# EAGLE schematic STM32MP1_board (EAGLE 6.4)

## Sheet 1 of 3: CPU
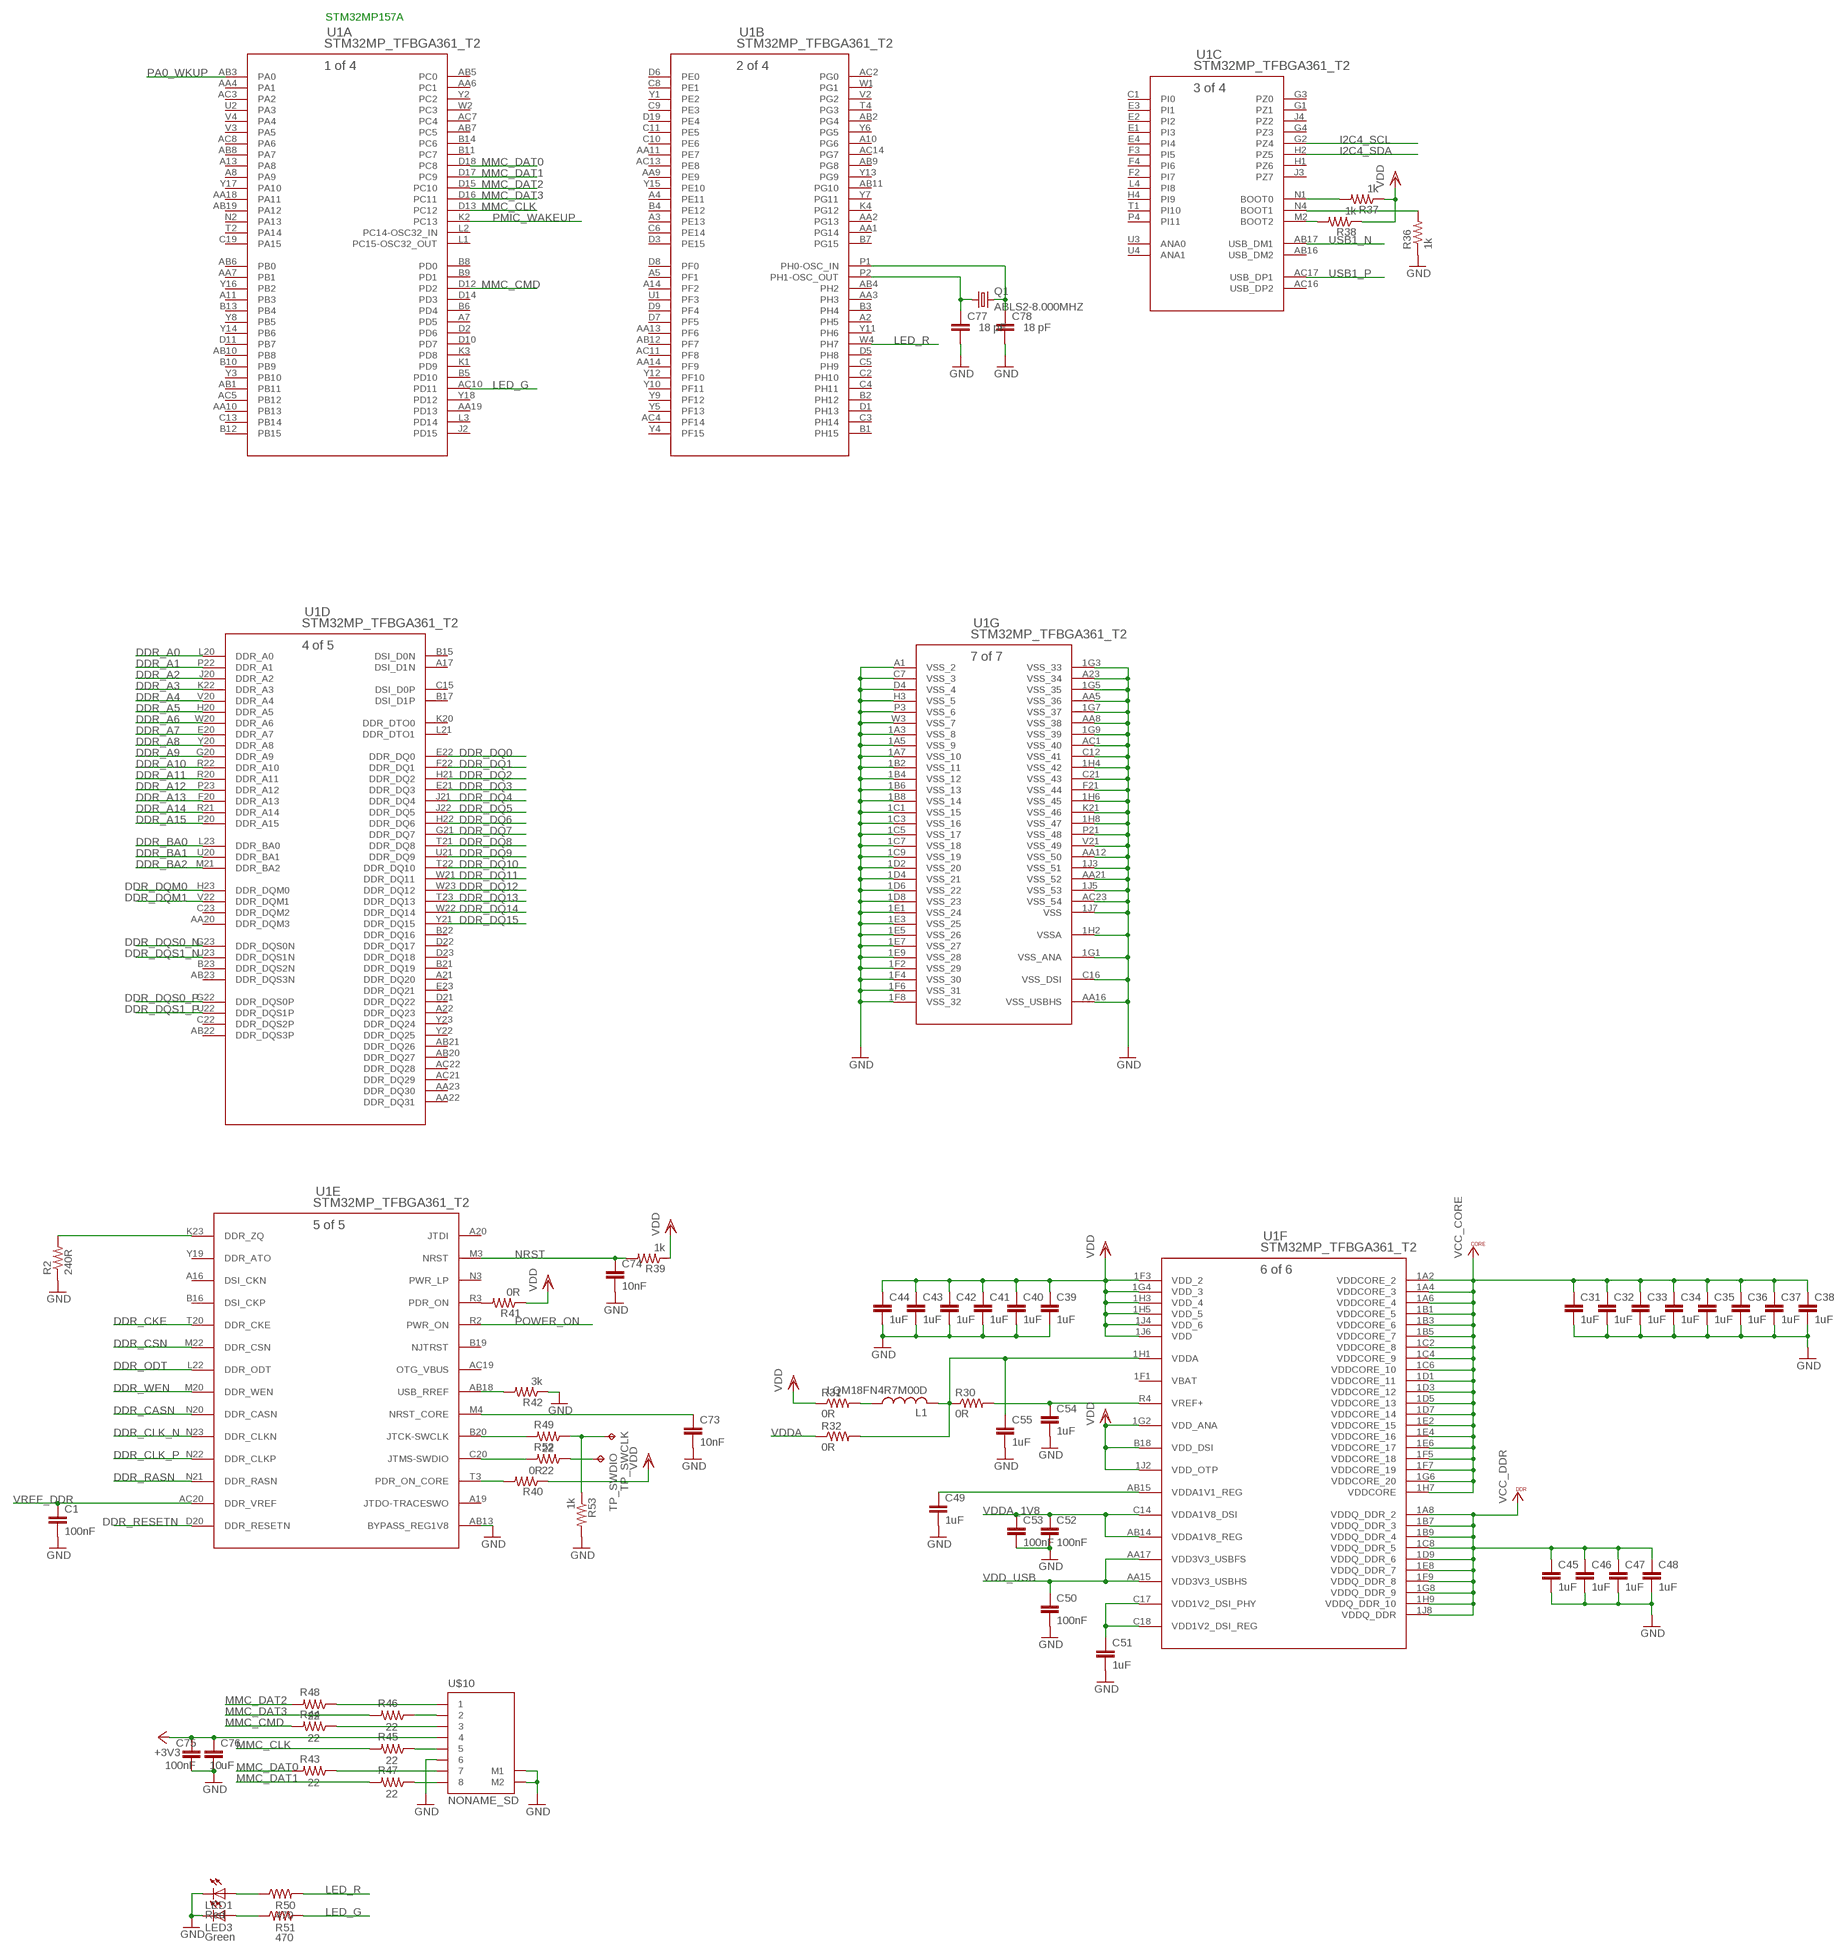
[diagram p0: schematic, sheet 1]

### Parts
C1  100nF  C-EUC0402K  [C0402K]
C31  1uF  C-EUC0402K  [C0402K]
C32  1uF  C-EUC0402K  [C0402K]
C33  1uF  C-EUC0402K  [C0402K]
C34  1uF  C-EUC0402K  [C0402K]
C35  1uF  C-EUC0402K  [C0402K]
C36  1uF  C-EUC0402K  [C0402K]
C37  1uF  C-EUC0402K  [C0402K]
C38  1uF  C-EUC0402K  [C0402K]
C39  1uF  C-EUC0402K  [C0402K]
C40  1uF  C-EUC0402K  [C0402K]
C41  1uF  C-EUC0402K  [C0402K]
C42  1uF  C-EUC0402K  [C0402K]
C43  1uF  C-EUC0402K  [C0402K]
C44  1uF  C-EUC0402K  [C0402K]
C45  1uF  C-EUC0402K  [C0402K]
C46  1uF  C-EUC0402K  [C0402K]
C47  1uF  C-EUC0402K  [C0402K]
C48  1uF  C-EUC0402K  [C0402K]
C49  1uF  C-EUC0402K  [C0402K]
C50  100nF  C-EUC0402K  [C0402K]
C51  1uF  C-EUC0402K  [C0402K]
C52  100nF  C-EUC0402K  [C0402K]
C53  100nF  C-EUC0402K  [C0402K]
C54  1uF  C-EUC0402K  [C0402K]
C55  1uF  C-EUC0402K  [C0402K]
C73  10nF  C-EUC0402K  [C0402K]
C74  10nF  C-EUC0402K  [C0402K]
C75  100nF  C-EUC0402K  [C0402K]
C76  10uF  C-EUC0603K  [C0603K]
C77  18 pF  C-EUC0603  [C0603]
C78  18 pF  C-EUC0603  [C0603]
L1  LQM18FN4R7M00D  L-US  [R0603]
LED1  Red  LED_ESML0603  [LED_SML0603]
LED3  Green  LED_ESML0603  [LED_SML0603]
Q1  ABLS2-8.000MHZ  CRYSTALSM49  [SM49]
R2  240R  R-US_R0402  [R0402]
R30  0R  R-US_R0402  [R0402]
R31  0R  R-US_R0402  [R0402]
R32  0R  R-US_R0402  [R0402]
R36  1k  R-US_R0402  [R0402]
R37  1k  R-US_R0402  [R0402]
R38  1k  R-US_R0402  [R0402]
R39  1k  R-US_R0402  [R0402]
R40  0R  R-US_R0402  [R0402]
R41  0R  R-US_R0402  [R0402]
R42  3k  R-US_R0402  [R0402]
R43  22  R-US_R0402  [R0402]
R44  22  R-US_R0402  [R0402]
R45  22  R-US_R0402  [R0402]
R46  22  R-US_R0402  [R0402]
R47  22  R-US_R0402  [R0402]
R48  22  R-US_R0402  [R0402]
R49  22  R-US_R0402  [R0402]
R50  470  R-US_R0402  [R0402]
R51  470  R-US_R0402  [R0402]
R52  22  R-US_R0402  [R0402]
R53  1k  R-US_R0402  [R0402]
TP_SWCLK  TPTP10SQ  [TP10SQ]
TP_SWDIO  TPTP10SQ  [TP10SQ]
U1  STM32MP_TFBGA361_T2  [TFBGA361_12X12]
U$10  NONAME_SD  [NONAME_SD]

### Nets
+3V3: C75.1 C76.1 U$10.4 ; also sheet 3
DDR_A0: U1.L20(D:DDR_A0) ; also sheet 2
DDR_A1: U1.P22(D:DDR_A1) ; also sheet 2
DDR_A2: U1.J20(D:DDR_A2) ; also sheet 2
DDR_A3: U1.K22(D:DDR_A3) ; also sheet 2
DDR_A4: U1.V20(D:DDR_A4) ; also sheet 2
DDR_A5: U1.H20(D:DDR_A5) ; also sheet 2
DDR_A6: U1.W20(D:DDR_A6) ; also sheet 2
DDR_A7: U1.E20(D:DDR_A7) ; also sheet 2
DDR_A8: U1.Y20(D:DDR_A8) ; also sheet 2
DDR_A9: U1.G20(D:DDR_A9) ; also sheet 2
DDR_A10: U1.R22(D:DDR_A10) ; also sheet 2
DDR_A11: U1.R20(D:DDR_A11) ; also sheet 2
DDR_A12: U1.P23(D:DDR_A12) ; also sheet 2
DDR_A13: U1.F20(D:DDR_A13) ; also sheet 2
DDR_A14: U1.R21(D:DDR_A14) ; also sheet 2
DDR_A15: U1.P20(D:DDR_A15)
DDR_BA0: U1.L23(D:DDR_BA0) ; also sheet 2
DDR_BA1: U1.U20(D:DDR_BA1) ; also sheet 2
DDR_BA2: U1.M21(D:DDR_BA2) ; also sheet 2
DDR_CASN: U1.N20(E:DDR_CASN) ; also sheet 2
DDR_CKE: U1.T20(E:DDR_CKE) ; also sheet 2
DDR_CLK_N: U1.N23(E:DDR_CLKN) ; also sheet 2
DDR_CLK_P: U1.N22(E:DDR_CLKP) ; also sheet 2
DDR_CSN: U1.M22(E:DDR_CSN) ; also sheet 2
DDR_DQ0: U1.E22(D:DDR_DQ0) ; also sheet 2
DDR_DQ1: U1.F22(D:DDR_DQ1) ; also sheet 2
DDR_DQ2: U1.H21(D:DDR_DQ2) ; also sheet 2
DDR_DQ3: U1.E21(D:DDR_DQ3) ; also sheet 2
DDR_DQ4: U1.J21(D:DDR_DQ4) ; also sheet 2
DDR_DQ5: U1.J22(D:DDR_DQ5) ; also sheet 2
DDR_DQ6: U1.H22(D:DDR_DQ6) ; also sheet 2
DDR_DQ7: U1.G21(D:DDR_DQ7) ; also sheet 2
DDR_DQ8: U1.T21(D:DDR_DQ8) ; also sheet 2
DDR_DQ9: U1.U21(D:DDR_DQ9) ; also sheet 2
DDR_DQ10: U1.T22(D:DDR_DQ10) ; also sheet 2
DDR_DQ11: U1.W21(D:DDR_DQ11) ; also sheet 2
DDR_DQ12: U1.W23(D:DDR_DQ12) ; also sheet 2
DDR_DQ13: U1.T23(D:DDR_DQ13) ; also sheet 2
DDR_DQ14: U1.W22(D:DDR_DQ14) ; also sheet 2
DDR_DQ15: U1.Y21(D:DDR_DQ15) ; also sheet 2
DDR_DQM0: U1.H23(D:DDR_DQM0) ; also sheet 2
DDR_DQM1: U1.V22(D:DDR_DQM1) ; also sheet 2
DDR_DQS0_N: U1.G23(D:DDR_DQS0N) ; also sheet 2
DDR_DQS0_P: U1.G22(D:DDR_DQS0P) ; also sheet 2
DDR_DQS1_N: U1.U23(D:DDR_DQS1N) ; also sheet 2
DDR_DQS1_P: U1.U22(D:DDR_DQS1P) ; also sheet 2
DDR_ODT: U1.L22(E:DDR_ODT) ; also sheet 2
DDR_RASN: U1.N21(E:DDR_RASN) ; also sheet 2
DDR_RESETN: U1.D20(E:DDR_RESETN) ; also sheet 2
DDR_WEN: U1.M20(E:DDR_WEN) ; also sheet 2
GND: C1.2 C31.2 C32.2 C33.2 C34.2 C35.2 C36.2 C37.2 C38.2 C39.2 C40.2 C41.2 C42.2 C43.2 C44.2 C45.2 C46.2 C47.2 C48.2 C49.2 C50.2 C51.2 C52.2 C53.2 C54.2 C55.2 C73.2 C74.2 C75.2 C76.2 C77.2 C78.2 LED1.C LED3.C R2.1 R36.1 R42.1 R53.2 U1.1A3(G:VSS_8) U1.1A5(G:VSS_9) U1.1A7(G:VSS_10) U1.1B2(G:VSS_11) U1.1B4(G:VSS_12) U1.1B6(G:VSS_13) U1.1B8(G:VSS_14) U1.1C1(G:VSS_15) U1.1C3(G:VSS_16) U1.1C5(G:VSS_17) U1.1C7(G:VSS_18) U1.1C9(G:VSS_19) U1.1D2(G:VSS_20) U1.1D4(G:VSS_21) U1.1D6(G:VSS_22) U1.1D8(G:VSS_23) U1.1E1(G:VSS_24) U1.1E3(G:VSS_25) U1.1E5(G:VSS_26) U1.1E7(G:VSS_27) U1.1E9(G:VSS_28) U1.1F2(G:VSS_29) U1.1F4(G:VSS_30) U1.1F6(G:VSS_31) U1.1F8(G:VSS_32) U1.1G1(G:VSS_ANA) U1.1G3(G:VSS_33) U1.1G5(G:VSS_35) U1.1G7(G:VSS_37) U1.1G9(G:VSS_39) U1.1H2(G:VSSA) U1.1H4(G:VSS_42) U1.1H6(G:VSS_45) U1.1H8(G:VSS_47) U1.1J3(G:VSS_51) U1.1J5(G:VSS_53) U1.1J7(G:VSS) U1.A1(G:VSS_2) U1.A23(G:VSS_34) U1.AA5(G:VSS_36) U1.AA8(G:VSS_38) U1.AA12(G:VSS_50) U1.AA16(G:VSS_USBHS) U1.AA21(G:VSS_52) U1.AB13(E:BYPASS_REG1V8) U1.AC1(G:VSS_40) U1.AC23(G:VSS_54) U1.C7(G:VSS_3) U1.C12(G:VSS_41) U1.C16(G:VSS_DSI) U1.C21(G:VSS_43) U1.D4(G:VSS_4) U1.F21(G:VSS_44) U1.H3(G:VSS_5) U1.K21(G:VSS_46) U1.P3(G:VSS_6) U1.P21(G:VSS_48) U1.V21(G:VSS_49) U1.W3(G:VSS_7) U$10.6 U$10.M1 U$10.M2 ; also sheet 2,3
I2C4_SCL: U1.G2(C:PZ4) ; also sheet 3
I2C4_SDA: U1.H2(C:PZ5) ; also sheet 3
LED_G: R51.2 U1.AC10(A:PD11)
LED_R: R50.2 U1.W4(B:PH7)
MMC_CLK: R45.2 U1.D13(A:PC12)
MMC_CMD: R44.2 U1.D12(A:PD2)
MMC_DAT0: R43.2 U1.D18(A:PC8)
MMC_DAT1: R47.2 U1.D17(A:PC9)
MMC_DAT2: R48.2 U1.D15(A:PC10)
MMC_DAT3: R46.2 U1.D16(A:PC11)
N$2: R2.2 U1.K23(E:DDR_ZQ)
N$3: C49.1 U1.AB15(F:VDDA1V1_REG)
N$4: C51.1 U1.C17(F:VDD1V2_DSI_PHY) U1.C18(F:VDD1V2_DSI_REG)
N$5: C55.1 L1.2 R30.1 R32.2 U1.1H1(F:VDDA)
N$6: C54.1 R30.2 U1.R4(F:VREF+)
N$7: L1.1 R31.2
N$15: C73.1 U1.M4(E:NRST_CORE)
N$17: R36.2 U1.N4(C:BOOT1)
N$18: R37.2 U1.N1(C:BOOT0)
N$19: R38.2 U1.M2(C:BOOT2)
N$20: C74.1 R39.2
N$21: R40.2 U1.T3(E:PDR_ON_CORE)
N$22: R41.2 U1.R3(E:PDR_ON)
N$23: R42.2 U1.AB18(E:USB_RREF)
N$24: R49.2 U1.B20(E:JTCK-SWCLK)
N$25: R52.2 U1.C20(E:JTMS-SWDIO)
N$26: R48.1 U$10.1
N$27: R46.1 U$10.2
N$28: R44.1 U$10.3
N$29: R45.1 U$10.5
N$30: R43.1 U$10.7
N$31: R47.1 U$10.8
N$32: R49.1 R53.1 TP_SWCLK.TP
N$33: R52.1 TP_SWDIO.TP
N$34: C78.1 Q1.2 U1.P1(B:PH0-OSC_IN)
N$35: C77.1 Q1.1 U1.P2(B:PH1-OSC_OUT)
N$37: LED1.A R50.1
N$39: LED3.A R51.1
NRST: U1.M3(E:NRST) ; also sheet 3
PA0_WKUP: U1.AB3(A:PA0) ; also sheet 3
PMIC_WAKEUP: U1.K2(A:PC13) ; also sheet 3
POWER_ON: U1.R2(E:PWR_ON) ; also sheet 3
USB1_N: U1.AB17(C:USB_DM1)
USB1_P: U1.AC17(C:USB_DP1)
VCC_CORE: C31.1 C32.1 C33.1 C34.1 C35.1 C36.1 C37.1 C38.1 U1.1A2(F:VDDCORE_2) U1.1A4(F:VDDCORE_3) U1.1A6(F:VDDCORE_4) U1.1B1(F:VDDCORE_5) U1.1B3(F:VDDCORE_6) U1.1B5(F:VDDCORE_7) U1.1C2(F:VDDCORE_8) U1.1C4(F:VDDCORE_9) U1.1C6(F:VDDCORE_10) U1.1D1(F:VDDCORE_11) U1.1D3(F:VDDCORE_12) U1.1D5(F:VDDCORE_13) U1.1D7(F:VDDCORE_14) U1.1E2(F:VDDCORE_15) U1.1E4(F:VDDCORE_16) U1.1E6(F:VDDCORE_17) U1.1F5(F:VDDCORE_18) U1.1F7(F:VDDCORE_19) U1.1G6(F:VDDCORE_20) U1.1H7(F:VDDCORE) ; also sheet 3
VCC_DDR: C45.1 C46.1 C47.1 C48.1 U1.1A8(F:VDDQ_DDR_2) U1.1B7(F:VDDQ_DDR_3) U1.1B9(F:VDDQ_DDR_4) U1.1C8(F:VDDQ_DDR_5) U1.1D9(F:VDDQ_DDR_6) U1.1E8(F:VDDQ_DDR_7) U1.1F9(F:VDDQ_DDR_8) U1.1G8(F:VDDQ_DDR_9) U1.1H9(F:VDDQ_DDR_10) U1.1J8(F:VDDQ_DDR) ; also sheet 2,3
VDD: C39.1 C40.1 C41.1 C42.1 C43.1 C44.1 R31.1 R37.1 R38.1 R39.1 R40.1 R41.1 U1.1F3(F:VDD_2) U1.1G2(F:VDD_ANA) U1.1G4(F:VDD_3) U1.1H3(F:VDD_4) U1.1H5(F:VDD_5) U1.1J2(F:VDD_OTP) U1.1J4(F:VDD_6) U1.1J6(F:VDD) U1.B18(F:VDD_DSI) ; also sheet 3
VDD_USB: C50.1 U1.AA15(F:VDD3V3_USBHS) U1.AA17(F:VDD3V3_USBFS) ; also sheet 3
VDDA: R32.1 ; also sheet 3
VDDA_1V8: C52.1 C53.1 U1.AB14(F:VDDA1V8_REG) U1.C14(F:VDDA1V8_DSI)
VREF_DDR: C1.1 U1.AC20(E:DDR_VREF) ; also sheet 2,3
Unconnected: U1.A2(B:PH5) U1.A3(B:PE13) U1.A4(B:PE11) U1.A5(B:PF1) U1.A7(A:PD5) U1.A8(A:PA9) U1.A10(B:PG6) U1.A11(A:PB3) U1.A13(A:PA8) U1.A14(B:PF2) U1.A16(E:DSI_CKN) U1.A17(D:DSI_D1N) U1.A19(E:JTDO-TRACESWO) U1.A20(E:JTDI) U1.A21(D:DDR_DQ20) U1.A22(D:DDR_DQ23) U1.AA1(B:PG14) U1.AA2(B:PG13) U1.AA3(B:PH3) U1.AA4(A:PA1) U1.AA6(A:PC1) U1.AA7(A:PB1) U1.AA9(B:PE9) U1.AA10(A:PB13) U1.AA11(B:PE7) U1.AA13(B:PF6) U1.AA14(B:PF9) U1.AA18(A:PA11) U1.AA19(A:PD13) U1.AA20(D:DDR_DQM3) U1.AA22(D:DDR_DQ31) U1.AA23(D:DDR_DQ30) U1.AB1(A:PB11) U1.AB2(B:PG4) U1.AB4(B:PH2) U1.AB5(A:PC0) U1.AB6(A:PB0) U1.AB7(A:PC5) U1.AB8(A:PA7) U1.AB9(B:PG8) U1.AB10(A:PB8) U1.AB11(B:PG10) U1.AB12(B:PF7) U1.AB16(C:USB_DM2) U1.AB19(A:PA12) U1.AB20(D:DDR_DQ27) U1.AB21(D:DDR_DQ26) U1.AB22(D:DDR_DQS3P) U1.AB23(D:DDR_DQS3N) U1.AC2(B:PG0) U1.AC3(A:PA2) U1.AC4(B:PF14) U1.AC5(A:PB12) U1.AC7(A:PC4) U1.AC8(A:PA6) U1.AC11(B:PF8) U1.AC13(B:PE8) U1.AC14(B:PG7) U1.AC16(C:USB_DP2) U1.AC19(E:OTG_VBUS) U1.AC21(D:DDR_DQ29) U1.AC22(D:DDR_DQ28) U1.B1(B:PH15) U1.B2(B:PH12) U1.B3(B:PH4) U1.B4(B:PE12) U1.B5(A:PD10) U1.B6(A:PD4) U1.B7(B:PG15) U1.B8(A:PD0) U1.B9(A:PD1) U1.B10(A:PB9) U1.B11(A:PC7) U1.B12(A:PB15) U1.B13(A:PB4) U1.B14(A:PC6) U1.B15(D:DSI_D0N) U1.B16(E:DSI_CKP) U1.B17(D:DSI_D1P) U1.B19(E:NJTRST) U1.B21(D:DDR_DQ19) U1.B22(D:DDR_DQ16) U1.B23(D:DDR_DQS2N) U1.C1(C:PI0) U1.C2(B:PH10) U1.C3(B:PH14) U1.C4(B:PH11) U1.C5(B:PH9) U1.C6(B:PE14) U1.C8(B:PE1) U1.C9(B:PE3) U1.C10(B:PE6) U1.C11(B:PE5) U1.C13(A:PB14) U1.C15(D:DSI_D0P) U1.C19(A:PA15) U1.C22(D:DDR_DQS2P) U1.C23(D:DDR_DQM2) U1.D1(B:PH13) U1.D2(A:PD6) U1.D3(B:PE15) U1.D5(B:PH8) U1.D6(B:PE0) U1.D7(B:PF5) U1.D8(B:PF0) U1.D9(B:PF4) U1.D10(A:PD7) U1.D11(A:PB7) U1.D14(A:PD3) U1.D19(B:PE4) U1.D21(D:DDR_DQ22) U1.D22(D:DDR_DQ17) U1.D23(D:DDR_DQ18) U1.E1(C:PI3) U1.E2(C:PI2) U1.E3(C:PI1) U1.E4(C:PI4) U1.E23(D:DDR_DQ21) U1.F2(C:PI7) U1.F3(C:PI5) U1.F4(C:PI6) U1.G1(C:PZ1) U1.G3(C:PZ0) U1.G4(C:PZ3) U1.H1(C:PZ6) U1.H4(C:PI9) U1.J2(A:PD15) U1.J3(C:PZ7) U1.J4(C:PZ2) U1.K1(A:PD9) U1.K3(A:PD8) U1.K4(B:PG12) U1.K20(D:DDR_DTO0) U1.L1(A:PC15-OSC32_OUT) U1.L2(A:PC14-OSC32_IN) U1.L3(A:PD14) U1.L4(C:PI8) U1.L21(D:DDR_DTO1) U1.N2(A:PA13) U1.N3(E:PWR_LP) U1.P4(C:PI11) U1.T1(C:PI10) U1.T2(A:PA14) U1.T4(B:PG3) U1.U1(B:PF3) U1.U2(A:PA3) U1.U3(C:ANA0) U1.U4(C:ANA1) U1.V2(B:PG2) U1.V3(A:PA5) U1.V4(A:PA4) U1.W1(B:PG1) U1.W2(A:PC3) U1.Y1(B:PE2) U1.Y2(A:PC2) U1.Y3(A:PB10) U1.Y4(B:PF15) U1.Y5(B:PF13) U1.Y6(B:PG5) U1.Y7(B:PG11) U1.Y8(A:PB5) U1.Y9(B:PF12) U1.Y10(B:PF11) U1.Y11(B:PH6) U1.Y12(B:PF10) U1.Y13(B:PG9) U1.Y14(A:PB6) U1.Y15(B:PE10) U1.Y16(A:PB2) U1.Y17(A:PA10) U1.Y18(A:PD12) U1.Y19(E:DDR_ATO) U1.Y22(D:DDR_DQ25) U1.Y23(D:DDR_DQ24)

### Notes on the sheet
- STM32MP157A

## Sheet 2 of 3: DDR3
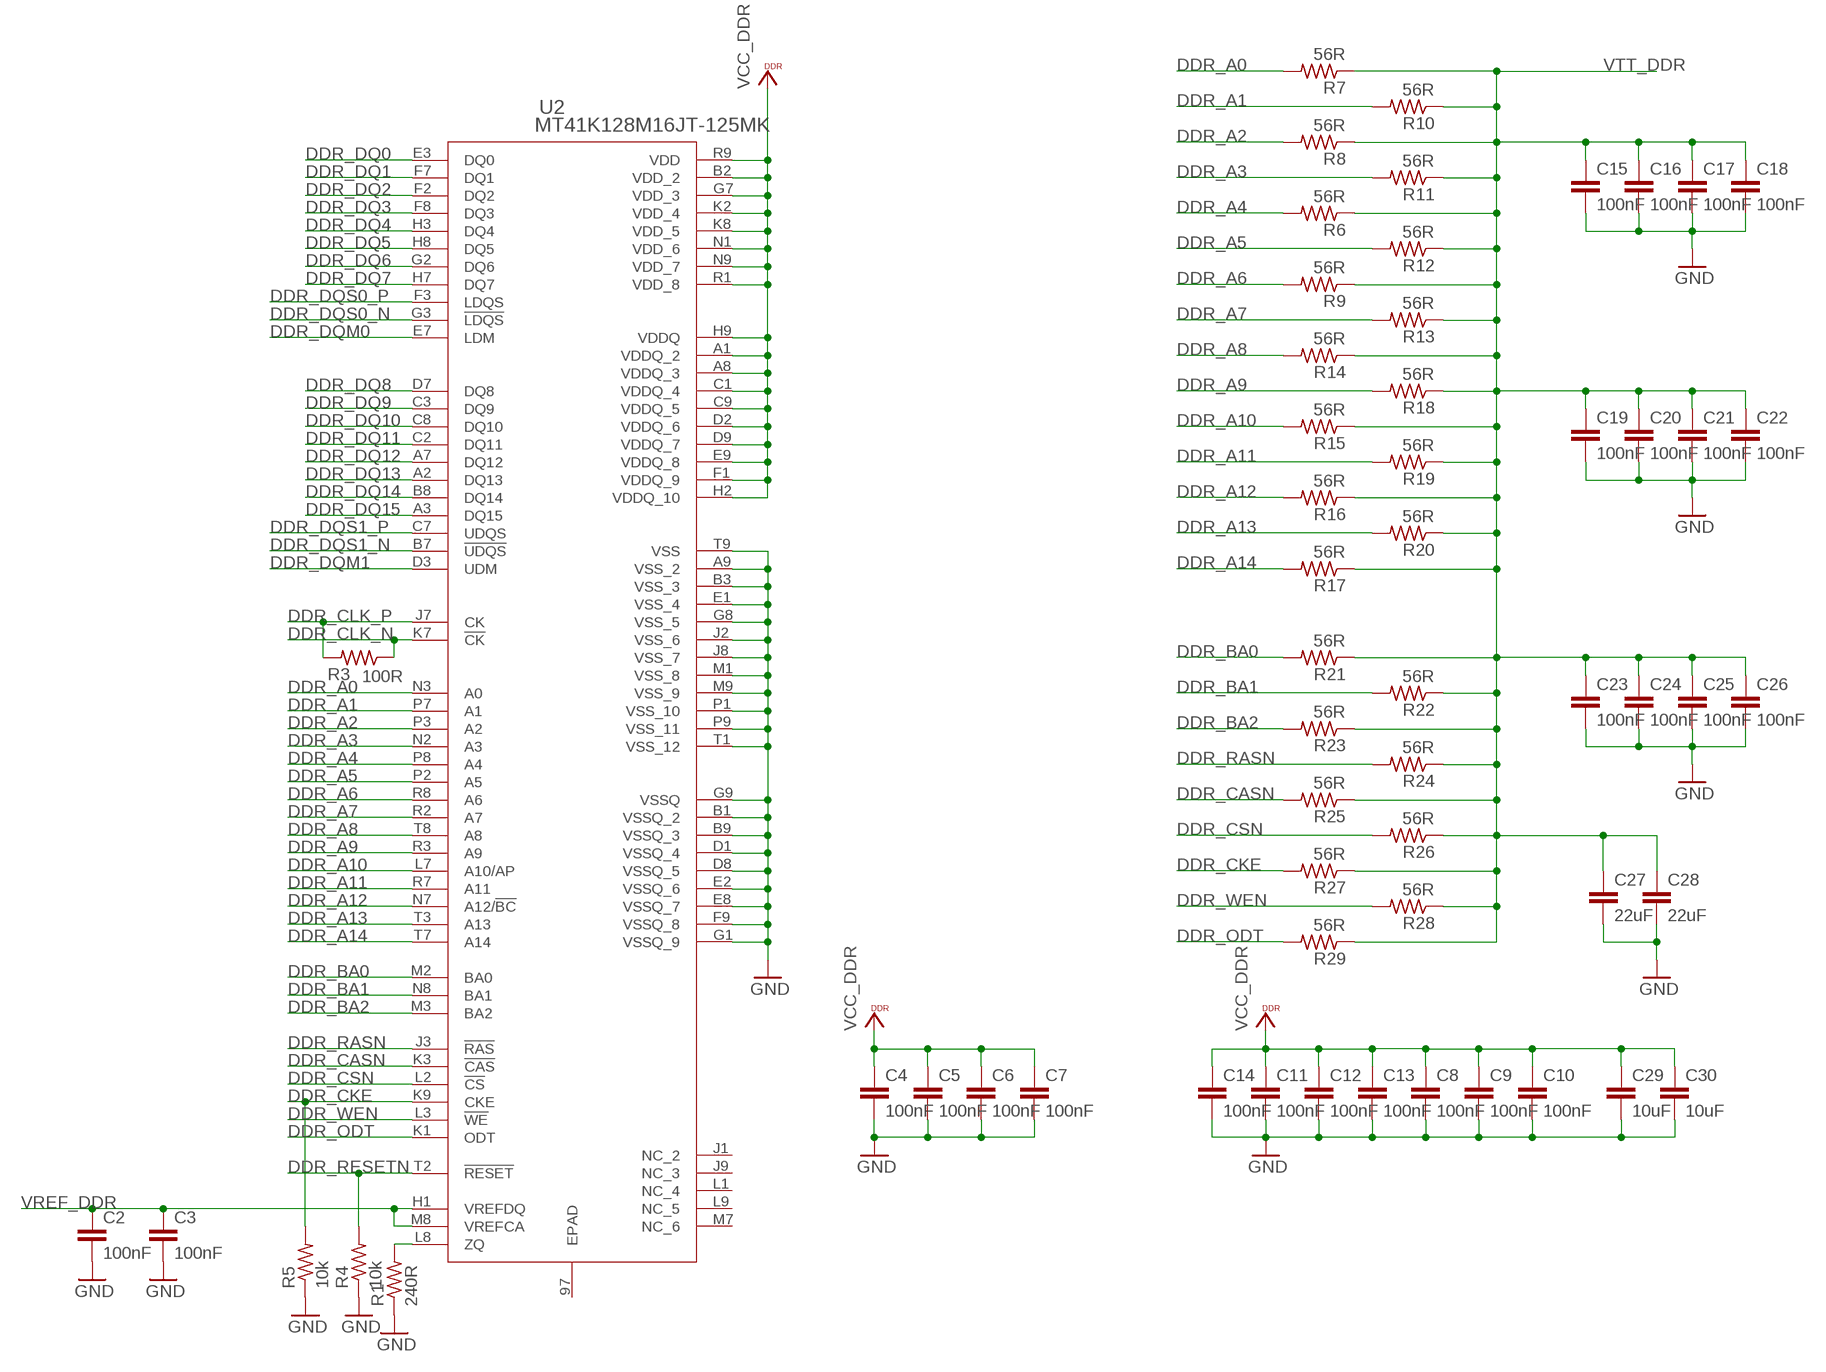
[diagram p1: schematic, sheet 2]

### Parts
C2  100nF  C-EUC0402K  [C0402K]
C3  100nF  C-EUC0402K  [C0402K]
C4  100nF  C-EUC0402K  [C0402K]
C5  100nF  C-EUC0402K  [C0402K]
C6  100nF  C-EUC0402K  [C0402K]
C7  100nF  C-EUC0402K  [C0402K]
C8  100nF  C-EUC0402K  [C0402K]
C9  100nF  C-EUC0402K  [C0402K]
C10  100nF  C-EUC0402K  [C0402K]
C11  100nF  C-EUC0402K  [C0402K]
C12  100nF  C-EUC0402K  [C0402K]
C13  100nF  C-EUC0402K  [C0402K]
C14  100nF  C-EUC0402K  [C0402K]
C15  100nF  C-EUC0402K  [C0402K]
C16  100nF  C-EUC0402K  [C0402K]
C17  100nF  C-EUC0402K  [C0402K]
C18  100nF  C-EUC0402K  [C0402K]
C19  100nF  C-EUC0402K  [C0402K]
C20  100nF  C-EUC0402K  [C0402K]
C21  100nF  C-EUC0402K  [C0402K]
C22  100nF  C-EUC0402K  [C0402K]
C23  100nF  C-EUC0402K  [C0402K]
C24  100nF  C-EUC0402K  [C0402K]
C25  100nF  C-EUC0402K  [C0402K]
C26  100nF  C-EUC0402K  [C0402K]
C27  22uF  C-EUC0603K  [C0603K]
C28  22uF  C-EUC0603K  [C0603K]
C29  10uF  C-EUC0603K  [C0603K]
C30  10uF  C-EUC0603K  [C0603K]
R1  240R  R-US_R0402  [R0402]
R3  100R  R-US_R0402  [R0402]
R4  10k  R-US_R0402  [R0402]
R5  10k  R-US_R0402  [R0402]
R6  56R  R-US_R0402  [R0402]
R7  56R  R-US_R0402  [R0402]
R8  56R  R-US_R0402  [R0402]
R9  56R  R-US_R0402  [R0402]
R10  56R  R-US_R0402  [R0402]
R11  56R  R-US_R0402  [R0402]
R12  56R  R-US_R0402  [R0402]
R13  56R  R-US_R0402  [R0402]
R14  56R  R-US_R0402  [R0402]
R15  56R  R-US_R0402  [R0402]
R16  56R  R-US_R0402  [R0402]
R17  56R  R-US_R0402  [R0402]
R18  56R  R-US_R0402  [R0402]
R19  56R  R-US_R0402  [R0402]
R20  56R  R-US_R0402  [R0402]
R21  56R  R-US_R0402  [R0402]
R22  56R  R-US_R0402  [R0402]
R23  56R  R-US_R0402  [R0402]
R24  56R  R-US_R0402  [R0402]
R25  56R  R-US_R0402  [R0402]
R26  56R  R-US_R0402  [R0402]
R27  56R  R-US_R0402  [R0402]
R28  56R  R-US_R0402  [R0402]
R29  56R  R-US_R0402  [R0402]
U2  MT41K128M16JT-125MK  [FBGA96_8X14]

### Nets
DDR_A0: R7.2 U2.N3(A0) ; also sheet 1
DDR_A1: R10.2 U2.P7(A1) ; also sheet 1
DDR_A2: R8.2 U2.P3(A2) ; also sheet 1
DDR_A3: R11.2 U2.N2(A3) ; also sheet 1
DDR_A4: R6.2 U2.P8(A4) ; also sheet 1
DDR_A5: R12.2 U2.P2(A5) ; also sheet 1
DDR_A6: R9.2 U2.R8(A6) ; also sheet 1
DDR_A7: R13.2 U2.R2(A7) ; also sheet 1
DDR_A8: R14.2 U2.T8(A8) ; also sheet 1
DDR_A9: R18.2 U2.R3(A9) ; also sheet 1
DDR_A10: R15.2 U2.L7(A10/AP) ; also sheet 1
DDR_A11: R19.2 U2.R7(A11) ; also sheet 1
DDR_A12: R16.2 U2.N7(A12/!BC) ; also sheet 1
DDR_A13: R20.2 U2.T3(A13) ; also sheet 1
DDR_A14: R17.2 U2.T7(A14) ; also sheet 1
DDR_BA0: R21.2 ; also sheet 1
DDR_BA1: R22.2 ; also sheet 1
DDR_BA2: R23.2 ; also sheet 1
DDR_CASN: R25.2 U2.K3(!CAS) ; also sheet 1
DDR_CKE: R5.2 R27.2 U2.K9(CKE) ; also sheet 1
DDR_CLK_N: R3.1 U2.K7(!CK) ; also sheet 1
DDR_CLK_P: R3.2 U2.J7(CK) ; also sheet 1
DDR_CSN: R26.2 U2.L2(!CS) ; also sheet 1
DDR_DQ0: U2.E3(DQ0) ; also sheet 1
DDR_DQ1: U2.F7(DQ1) ; also sheet 1
DDR_DQ2: U2.F2(DQ2) ; also sheet 1
DDR_DQ3: U2.F8(DQ3) ; also sheet 1
DDR_DQ4: U2.H3(DQ4) ; also sheet 1
DDR_DQ5: U2.H8(DQ5) ; also sheet 1
DDR_DQ6: U2.G2(DQ6) ; also sheet 1
DDR_DQ7: U2.H7(DQ7) ; also sheet 1
DDR_DQ8: U2.D7(DQ8) ; also sheet 1
DDR_DQ9: U2.C3(DQ9) ; also sheet 1
DDR_DQ10: U2.C8(DQ10) ; also sheet 1
DDR_DQ11: U2.C2(DQ11) ; also sheet 1
DDR_DQ12: U2.A7(DQ12) ; also sheet 1
DDR_DQ13: U2.A2(DQ13) ; also sheet 1
DDR_DQ14: U2.B8(DQ14) ; also sheet 1
DDR_DQ15: U2.A3(DQ15) ; also sheet 1
DDR_DQM0: U2.E7(LDM) ; also sheet 1
DDR_DQM1: U2.D3(UDM) ; also sheet 1
DDR_DQS0_N: U2.G3(!LDQS) ; also sheet 1
DDR_DQS0_P: U2.F3(LDQS) ; also sheet 1
DDR_DQS1_N: U2.B7(!UDQS) ; also sheet 1
DDR_DQS1_P: U2.C7(UDQS) ; also sheet 1
DDR_ODT: R29.2 U2.K1(ODT) ; also sheet 1
DDR_RASN: R24.2 U2.J3(!RAS) ; also sheet 1
DDR_RESETN: R4.2 U2.T2(!RESET) ; also sheet 1
DDR_WEN: R28.2 U2.L3(!WE) ; also sheet 1
GND: C2.2 C3.2 C4.2 C5.2 C6.2 C7.2 C8.2 C9.2 C10.2 C11.2 C12.2 C13.2 C14.2 C15.2 C16.2 C17.2 C18.2 C19.2 C20.2 C21.2 C22.2 C23.2 C24.2 C25.2 C26.2 C27.2 C28.2 C29.2 C30.2 R1.1 R4.1 R5.1 U2.A9(VSS_2) U2.B1(VSSQ_2) U2.B3(VSS_3) U2.B9(VSSQ_3) U2.D1(VSSQ_4) U2.D8(VSSQ_5) U2.E1(VSS_4) U2.E2(VSSQ_6) U2.E8(VSSQ_7) U2.F9(VSSQ_8) U2.G1(VSSQ_9) U2.G8(VSS_5) U2.G9(VSSQ) U2.J2(VSS_6) U2.J8(VSS_7) U2.M1(VSS_8) U2.M9(VSS_9) U2.P1(VSS_10) U2.P9(VSS_11) U2.T1(VSS_12) U2.T9(VSS) ; also sheet 1,3
N$1: R1.2 U2.L8(ZQ)
VCC_DDR: C4.1 C5.1 C6.1 C7.1 C8.1 C9.1 C10.1 C11.1 C12.1 C13.1 C14.1 C29.1 C30.1 U2.A1(VDDQ_2) U2.A8(VDDQ_3) U2.B2(VDD_2) U2.C1(VDDQ_4) U2.C9(VDDQ_5) U2.D2(VDDQ_6) U2.D9(VDDQ_7) U2.E9(VDDQ_8) U2.F1(VDDQ_9) U2.G7(VDD_3) U2.H2(VDDQ_10) U2.H9(VDDQ) U2.K2(VDD_4) U2.K8(VDD_5) U2.N1(VDD_6) U2.N9(VDD_7) U2.R1(VDD_8) U2.R9(VDD) ; also sheet 1,3
VREF_DDR: C2.1 C3.1 U2.M8(VREFCA) ; also sheet 1,3
VTT_DDR: C15.1 C16.1 C17.1 C18.1 C19.1 C20.1 C21.1 C22.1 C23.1 C24.1 C25.1 C26.1 C27.1 C28.1 R6.1 R7.1 R8.1 R9.1 R10.1 R11.1 R12.1 R13.1 R14.1 R15.1 R16.1 R17.1 R18.1 R19.1 R20.1 R21.1 R22.1 R23.1 R24.1 R25.1 R26.1 R27.1 R28.1 R29.1 ; also sheet 3
Unconnected: U2.97(EPAD) U2.J1(NC_2) U2.J9(NC_3) U2.L1(NC_4) U2.L9(NC_5) U2.M2(BA0) U2.M3(BA2) U2.M7(NC_6) U2.N8(BA1)

## Sheet 3 of 3: PMIC
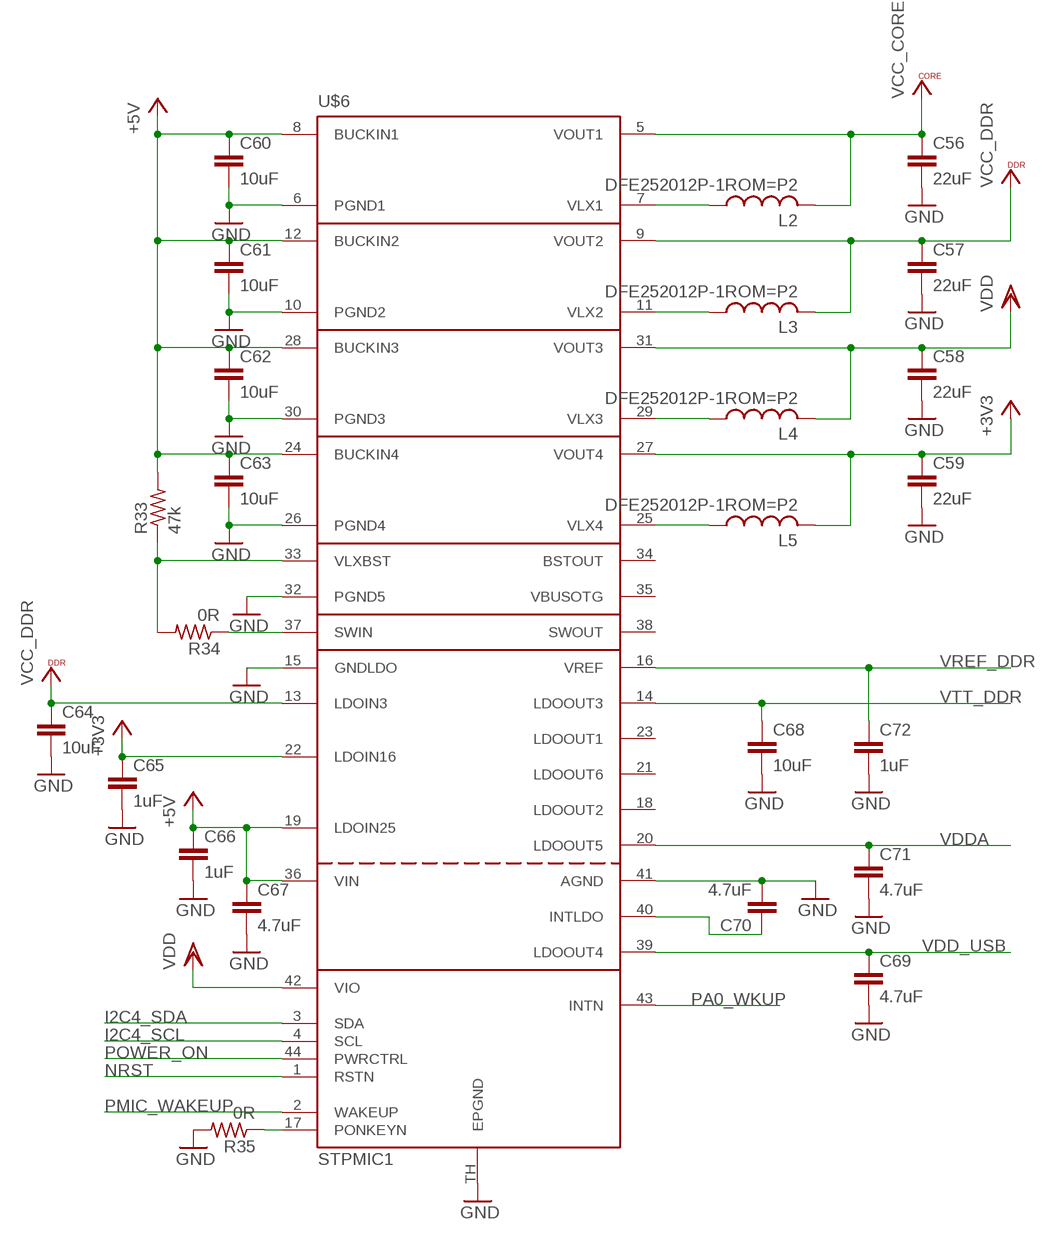
[diagram p2: schematic, sheet 3]

### Parts
C56  22uF  C-EUC0603K  [C0603K]
C57  22uF  C-EUC0603K  [C0603K]
C58  22uF  C-EUC0603K  [C0603K]
C59  22uF  C-EUC0603K  [C0603K]
C60  10uF  C-EUC0603K  [C0603K]
C61  10uF  C-EUC0603K  [C0603K]
C62  10uF  C-EUC0603K  [C0603K]
C63  10uF  C-EUC0603K  [C0603K]
C64  10uF  C-EUC0603K  [C0603K]
C65  1uF  C-EUC0402K  [C0402K]
C66  1uF  C-EUC0402K  [C0402K]
C67  4.7uF  C-EUC0402K  [C0402K]
C68  10uF  C-EUC0603K  [C0603K]
C69  4.7uF  C-EUC0402K  [C0402K]
C70  4.7uF  C-EUC0402K  [C0402K]
C71  4.7uF  C-EUC0402K  [C0402K]
C72  1uF  C-EUC0402K  [C0402K]
L2  DFE252012P-1ROM=P2  L-USL2825P  [L2825P]
L3  DFE252012P-1ROM=P2  L-USL2825P  [L2825P]
L4  DFE252012P-1ROM=P2  L-USL2825P  [L2825P]
L5  DFE252012P-1ROM=P2  L-USL2825P  [L2825P]
R33  47k  R-US_R0402  [R0402]
R34  0R  R-US_R0402  [R0402]
R35  0R  R-US_R0402  [R0402]
U$6  STPMIC1  [MLF44-TH]

### Nets
+3V3: C59.1 C65.1 L5.2 U$6.22(LDOIN16) U$6.27(VOUT4) ; also sheet 1
+5V: C60.1 C61.1 C62.1 C63.1 C66.1 C67.1 R33.2 U$6.8(BUCKIN1) U$6.12(BUCKIN2) U$6.19(LDOIN25) U$6.24(BUCKIN4) U$6.28(BUCKIN3) U$6.36(VIN)
GND: C56.2 C57.2 C58.2 C59.2 C60.2 C61.2 C62.2 C63.2 C64.2 C65.2 C66.2 C67.2 C68.2 C69.2 C70.2 C71.2 C72.2 R35.2 U$6.6(PGND1) U$6.10(PGND2) U$6.15(GNDLDO) U$6.26(PGND4) U$6.30(PGND3) U$6.32(PGND5) U$6.41(AGND) U$6.TH(EPGND) ; also sheet 1,2
I2C4_SCL: U$6.4(SCL) ; also sheet 1
I2C4_SDA: U$6.3(SDA) ; also sheet 1
N$8: L2.1 U$6.7(VLX1)
N$9: L3.1 U$6.11(VLX2)
N$10: L4.1 U$6.29(VLX3)
N$11: L5.1 U$6.25(VLX4)
N$12: R33.1 R34.2 U$6.33(VLXBST)
N$13: R34.1 U$6.37(SWIN)
N$14: R35.1 U$6.17(PONKEYN)
N$16: C70.1 U$6.40(INTLDO)
NRST: U$6.1(RSTN) ; also sheet 1
PA0_WKUP: U$6.43(INTN) ; also sheet 1
PMIC_WAKEUP: U$6.2(WAKEUP) ; also sheet 1
POWER_ON: U$6.44(PWRCTRL) ; also sheet 1
VCC_CORE: C56.1 L2.2 U$6.5(VOUT1) ; also sheet 1
VCC_DDR: C57.1 C64.1 L3.2 U$6.9(VOUT2) U$6.13(LDOIN3) ; also sheet 1,2
VDD: C58.1 L4.2 U$6.31(VOUT3) U$6.42(VIO) ; also sheet 1
VDD_USB: C69.1 U$6.39(LDOOUT4) ; also sheet 1
VDDA: C71.1 U$6.20(LDOOUT5) ; also sheet 1
VREF_DDR: C72.1 U$6.16(VREF) ; also sheet 1,2
VTT_DDR: C68.1 U$6.14(LDOOUT3) ; also sheet 2
Unconnected: U$6.18(LDOOUT2) U$6.21(LDOOUT6) U$6.23(LDOOUT1) U$6.34(BSTOUT) U$6.35(VBUSOTG) U$6.38(SWOUT)

## Power pins joined to a net without a drawn wire
VBAT: U1.1F1(F:VBAT)
VREFDQ: U2.H1(VREFDQ)

## Library data of the parts
C1-C78 = rcl:C-EU: CAPACITOR, European symbol
L1-L5 = rcl:L-US: INDUCTOR, American symbol
LED1 LED3 = eagle-ltspice:LED_E: LED Source: http://www.osram.convergy.de Source: www.luxeon.com Source: www.kingbright.com; SPICEMODEL: NONE; SPICEPREFIX: D; SPICETYPE: diode
Q1 = adafruit:CRYSTAL: CRYSTAL; OC_FARNELL: unknown; OC_NEWARK: unknown
R1-R42 R53 = rcl:R-US_: RESISTOR, American symbol
R43-R52 = resistor:R-US_: RESISTOR, American symbol
TP_SWCLK TP_SWDIO = testpad:TP: Test pad
U1 = STM32MP1:STM32MP_TFBGA361_T2; MANUFACTURER_PART_NUMBER: STM32MP_TFBGA361_T2; VENDOR: STMicroelectronics
U2 = MT41K:MT41K128M16JT-125MK; MANUFACTURER_PART_NUMBER: MT41K128M16JT125MK; VENDOR: Micron
U$6 = STPMIC1:STPMIC1
U$10 = uSD:NONAME_SD